# Altium project Arduino_Nano.PrjPcb
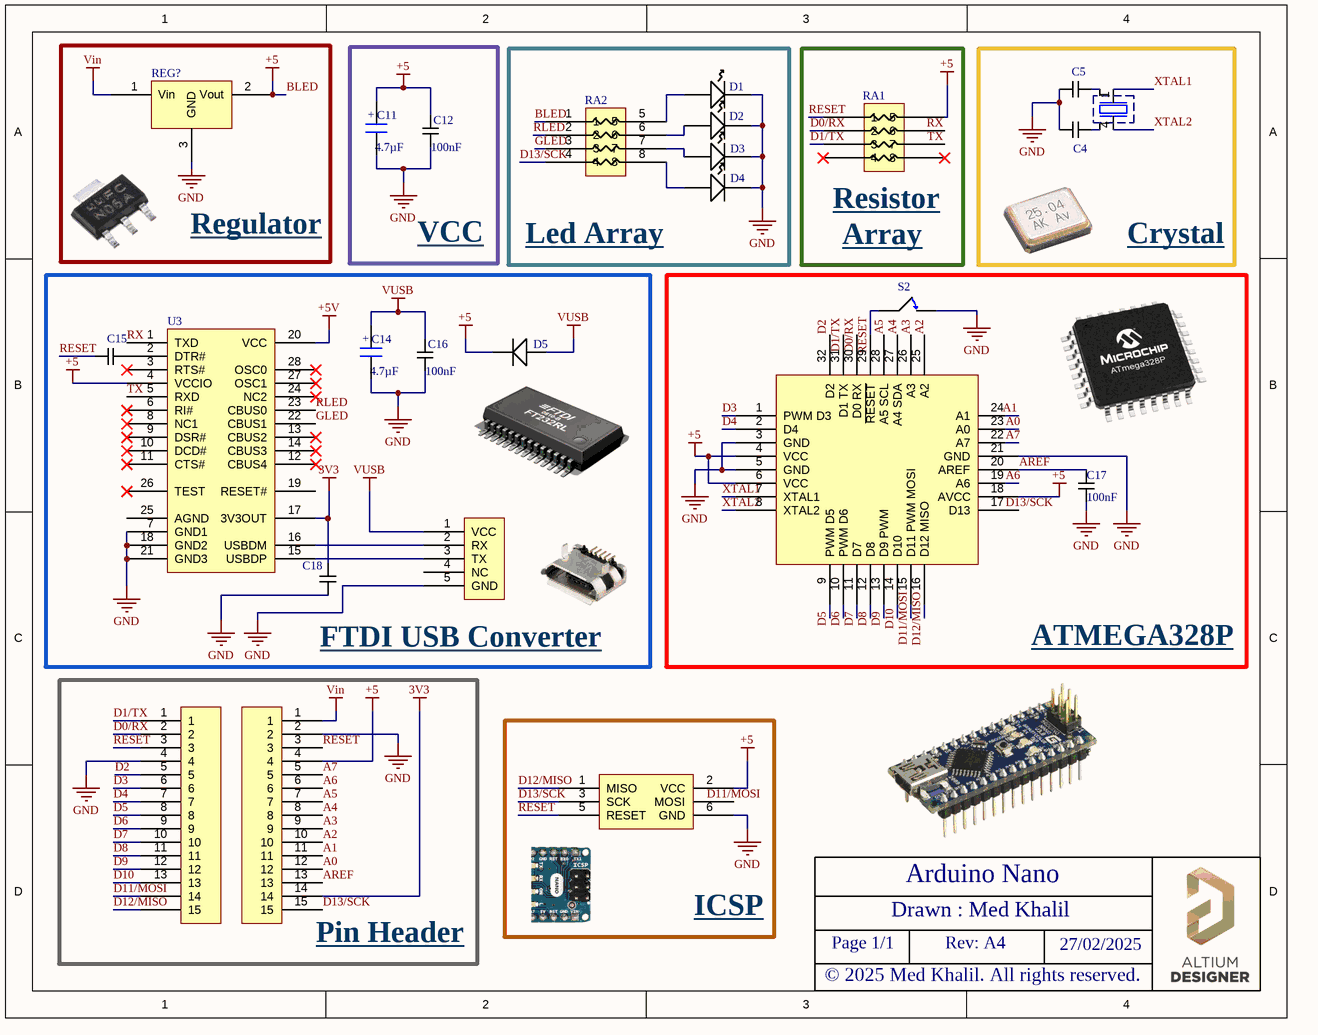
[diagram p0: Sheet1.SchDoc]
Date: 26/02/2025; Designer: Med Khalil; Project: Arduino Nano
1 sheet, 25 parts. Net scope: global (net labels, ports and power ports of the same name join across sheets).
Board file: PCB1.PcbDoc

## Sheet Sheet1.SchDoc
size A; SheetNumber: 1; SheetTotal: 1; ENG_APP_DATE: --/--/--; DSN_APP_DATE: --/--/--; CHK_APP_DATE: --/--/--

### Parts
1  Aker 16MHz Crystal SMT  [Aker S5C Crystal]  (value not drawn)
C4  C0805C180J5GACTU  [CAPCP2012X09N]  (value not drawn)
C5  C0805C180J5GACTU  [CAPCP2012X09N]  (value not drawn)
C11  value 4.7µF  [CASE A - 3216X18]  (hidden comment: Capacitor SMT Tantalum)
C12  Capacitance: 100nF  [CAPCP2012X09N]  (hidden comment: 100nF Ceramic Multilayer Capacitor_1)
C14  value 4.7µF  [CASE A - 3216X18]  (hidden comment: Capacitor SMT Tantalum)
C15  C0805C180J5GACTU  [CAPCP2012X09N]  (value not drawn)
C16  Capacitance: 100nF  [CAPCP2012X09N]  (hidden comment: 100nF Ceramic Multilayer Capacitor_1)
C17  Capacitance: 100nF  [CAPCP2012X09N]  (hidden comment: 100nF Ceramic Multilayer Capacitor_1)
C18  100nF Ceramic Multilayer Capacitor_1  [CAPCP2012X09N]  (value not drawn)
D1  Kingbright Blue LED, 60 mcd 120 ° 0805  [LED1913X12NBLUE]  (value not drawn)
D2  Kingbright Red LED, 100 mcd 120 ° 0805  [LED1913X12NRED]  (value not drawn)
D3  Kingbright Green LED, 70 mcd 120 ° 0805  [LED1913X12NGREEN]  (value not drawn)
D4  Kingbright Orange LED, 200 mcd 120 ° 0805  [LED1913X12NYEL/ORANGE]  (value not drawn)
D5  Panasonic DB2J20900L Schottky Diode, 0.5A, 20V, 2.4ns, 2-Pin SMini2 F5 B  [DIOM1712X07N]  (value not drawn)
RA1  1k +- 5% SMT Resistor Array  [1206 RA]  (value not drawn)
RA2  680+- 5% SMT Resistor Array  [1206 RA]  (value not drawn)
REG?  (no value)  [SOT230P700X180-4N]
S2  Button Tactile Switch, NO 0.05 A 0.8mm  [Button8014X17N]  (value not drawn)
S4  connector;str header;single row;.1 cont centers;.095 tail;gold or gtx;36 contact  [Header]  (value not drawn)
S5  Programming Headers Dual Row  [ISP HEADER]  (value not drawn)
S11  connector;str header;single row;.1 cont centers;.095 tail;gold or gtx;36 contact  [Header]  (value not drawn)
S12  NewMolex Right Angle SMT Female Type B Micro USB Connector, 30 V ac, 1.8A  [MicroUSB]  (value not drawn)
U3  FT232RL, Universal Asynchronous Receiver & Transmitter 3MBd, 28-Pin, SSOP  [SOP65P780X200-28N]  (value not drawn)
U4  ATMEGA328P-AU  [TQFP80P900X900X120-32N]  (value not drawn)

### Blocks framed on the sheet
Regulator: REG?
VCC: C11 C12
Led Array: D1-D4 RA2
Crystal: 1 C4 C5
FTDI USB Converter: C14-C16 C18 D5 S12 U3
ATMEGA328P: C17 S2 U4
Pin Header: S4 S11
ICSP: S5

### Nets
3V3: C18.2 S11.14 U3.17(3V3OUT)
+5V: U3.20(VCC)
BLED: C11.1 C12.2 D5.1 RA1.5 RA2.1 REG?.2(Vout) S5.2(VCC) S11.4 U3.4(VCCIO) U4.4(VCC) U4.6(VCC) U4.18(AVCC)  [also labelled +5]
GND: C4.2 C5.2 C11.2 C12.1 C14.2 C16.1 C17.1 C18.1 D1.2(K) D2.2(K) D3.2(K) D4.2(K) REG?.3(GND) S2.1 S4.4 S5.6(GND) S11.2 S12.5(GND) U3.7(GND1) U3.18(GND2) U3.21(GND3) U4.3(GND) U4.5(GND) U4.21(GND)
Vin: REG?.1(Vin) S11.1
VUSB: C14.1 C16.2 D5.2 S12.1(VCC)
A0: S11.12 U4.23(A0)
A1: S11.11 U4.24(A1)
A2: S11.10 U4.26(A3)
A3: S11.9 U4.27(A4_SDA)
A4: S11.8 U4.28(A5_SCL)
A5: C15.1 RA1.1 S2.1 S4.3 S5.5(RESET) S11.3 S11.7 U4.29(~{RESET})  [also labelled RESET]
A6: S11.6 U4.19(A6)
A7: S11.5 U4.22(A7)
AREF: C17.2 S11.13 U4.20(AREF)
D0/RX: RA1.2 S4.2 U4.30(D0_RX)
D1/TX: RA1.3 S4.1 U4.31(D1_TX)
D2: S4.5 U4.32(D2)
D3: S4.6 U4.1(PWM_D3)
D4: S4.7 U4.2(D4)
D5: S4.8 U4.9(PWM_D5)
D6: S4.9 U4.10(PWM_D6)
D7: S4.10 U4.11(D7)
D8: S4.11 U4.12(D8)
D9: S4.12 U4.13(D9_PWM)
D10: S4.13 U4.14(D10)
D11/MOSI: S4.14 S5.4(MOSI) U4.15(D11_PWM_MOSI)
D12/MISO: S4.15 S5.1(MISO) U4.16(D12_MISO)
D13/SCK: RA2.4 S5.3(SCK) S11.15
GLED: RA2.3 U3.22(CBUS1)
RLED: RA2.2 U3.23(CBUS0)
RX: RA1.6 U3.1(TXD)
TX: RA1.7 U3.5(RXD)
XTAL1: 1.1 U4.7(XTAL1)
XTAL2: 1.4 U4.8(XTAL2)
Net1_2: 1.2(Gnd) C4.1
Net1_3: 1.3(Gnd) C5.1
NetC15_2: C15.2 U3.2(DTR#)
NetD1_1: D1.1(A) RA2.5
NetD2_1: D2.1(A) RA2.6
NetD3_1: D3.1(A) RA2.7
NetD4_1: D4.1(A) RA2.8
NetS12_2: S12.2(RX) U3.16(USBDM)
NetS12_3: S12.3(TX) U3.15(USBDP)

Not connected (* = marked no-connect by the designer): RA1 4* 8*; S12 4(NC); U3 3(RTS#)* 6(RI#)* 8(NC1)* 9(DSR#)* 10(DCD#)* 11(CTS#)* 12(CBUS4)* 13(CBUS2)* 14(CBUS3)* 19(RESET#) 24(NC2)* 25(AGND) 26(TEST)* 27(OSC1)* 28(OSC0)*; U4 17(D13) 25(A2)

### Notes on the sheet
- (near RA1) Resistor
- Array
- Arduino Nano
- Page 1/1
- Drawn : Med Khalil
- Rev: A4
- 27/02/2025
- © 2025 Med Khalil. All rights reserved.
- Labels drawn without touching a wire or pin: D13/SCK
- DWG. NO.
- REV.
- SHT.
- REVISION
- DESCRIPTION
- DATE
- APPROVED
- THIS DOCUMENT AND THE DATA DISCLOSED HEREIN OR HEREWITH IS THE PROPERTY OF ALTIUM LIMITED AND MAY BE FREELY DISTRIBUTED IN WHOLE. NO RIGHTS ARE RESERVED OR EXPRESS OR IMPLIED WARANTEE GIVEN.
- ENG:
- DSN:
- APPROVALS
- PROJECT
- DOCUMENT REVISION:
- DESIGN ITEM:
- CHK:
- BOM:
- REFERENCE DOCUMENTS
- PROJECT REVISION:
- TITLE
- FAB DWG:
- PCB DWG:
- ASSY DWG:
- SCALE:
- SIZE
- C
- CAGE CODE
- FILE NAME
- DWG NO.
- SHEET
- OF
- REV
- (in symbol 4.7µF Tant RS 496-3545) +

### Library data of the parts
1 = Aker  C5S-16.000-12-3030-X: Aker S5C SMT Crystal; Load Capacitance: 12pF; Frequency Stability: +/-30ppm; RS: RS 671-9488; Creator: R Kanjee; Manufacturer: Aker; Manufacturer Part #: C5S-16.000-12-3030-X; Supplier: RS; RS Stock Nr.: 671-9488; HelpURL: http://za.rs-online.com/web/p/crystal-units/6719488/; Package: 3.2x5mm SMD; Value: 16MHz
C4 C5 = 18pF Ceramic Multilayer Capacitor, 50 V dc C0G Dielectric ±5% SMD: Manufacturer: Kemet; Voltage: 50V; Capacitance: 15pF; Creator: Ritesh Kanjee; Date Created: 18 February 2015; Package: 0805; RS Stock No.: 648-0935; Datasheet URL: http://za.rs-online.com/web/p/ceramic-multilayer-capacitors/6480935/?searchTerm=C0805C180J5GACTU&relevancy-data=636F3D3226696E3D4931384E4B6E6F776E41734D504E266C753D656E266D6D3D6D61746368616C6C7061727469616C26706D3D5E5B5C707B4C7D5C707B4E647D2D2C2F255C2E5D2B2426706F3D313326736E3D592673743D4D414E5F504152545F4E554D4245522677633D424F5448267573743D4330383035433138304A35474143545526
C11 C14 = 4.7µF Tant RS 496-3545: Capacitor,tantalum,SMT,16V,4.7uF,10%,A-case; Part Originator: H Theron; RS Stock Nr.: 496-3545; Tolerance: 10%; Package: 3216-18; Publisher: DPSS; LatestRevisionDate: 28-April-2010; ComponentLink1Description: Supplier Website; ComponentLink1URL: http://za.rs-online.com/web/search/searchBrowseAction.html?method=getProduct&R=4963545; ComponentLink2Description: RS Data sheet; ComponentLink2URL: http://docs-europe.origin.electrocomponents.com/webdocs/04ed/0900766b804ed4cc.pdf; Voltage: 16V
C12 C16-C18 = 100nF Ceramic Multilayer Capacitor_1: AVX 0805 Standard 100nF Ceramic Multilayer Capacitor, 50 V dc X7R Dielectric ±10% SMD; Voltage: 50V; Creator: Ritesh Kanjee; Date Created: 18 February 2015; Package: 0805; Manufacturer: AVX; RS Stock No.: 464-6688; Datasheet URL: http://za.rs-online.com/web/p/ceramic-multilayer-capacitors/4646688/
  C18: Capacitance: 100nF
C15 = 18pF Ceramic Multilayer Capacitor, 50 V dc C0G Dielectric ±5% SMD: Manufacturer: Kemet; Voltage: 50V; Creator: Ritesh Kanjee; Date Created: 18 February 2015; Package: 0805; RS Stock No.: 648-0935; Datasheet URL: http://za.rs-online.com/web/p/ceramic-multilayer-capacitors/6480935/?searchTerm=C0805C180J5GACTU&relevancy-data=636F3D3226696E3D4931384E4B6E6F776E41734D504E266C753D656E266D6D3D6D61746368616C6C7061727469616C26706D3D5E5B5C707B4C7D5C707B4E647D2D2C2F255C2E5D2B2426706F3D313326736E3D592673743D4D414E5F504152545F4E554D4245522677633D424F5448267573743D4330383035433138304A35474143545526; Capacitance: 18pF
D1 = Kingbright Blue LED, 60 mcd 120 ° 0805: Manufacturer Part No.: KP-2012PBC-A; Forward Voltage: 3.2V; Creator: Ritesh Kanjee; Date Created: 18 February 2015; Manufacturer: KingBright; RS Stock No.: 466-3784; Datasheet URL: http://za.rs-online.com/web/p/visible-leds/4663784/; Color: Blue
D2 = Kingbright Red LED, 100 mcd 120 ° 0805: Manufacturer Part No.: KP-2012SRC-PRV; Forward Voltage: 1.85V; Creator: Ritesh Kanjee; Date Created: 18 February 2015; Manufacturer: KingBright; RS Stock No.: 466-3813; Datasheet URL: http://za.rs-online.com/web/p/visible-leds/4663813/; Color: RED
D3 = Kingbright Green LED, 70 mcd 120 ° 0805: Manufacturer Part No.: KP-2012MGC; Forward Voltage: 2.1 V; Creator: Ritesh Kanjee; Date Created: 18 February 2015; Manufacturer: KingBright; RS Stock No.: 466-3778; Datasheet URL: http://za.rs-online.com/web/p/visible-leds/4663778/; Color: Green
D4 = Kingbright Orange LED, 200 mcd 120 ° 0805: Manufacturer Part No.: KP-2012SEC; Forward Voltage: 1.85V; Creator: Ritesh Kanjee; Date Created: 18 February 2015; Manufacturer: KingBright; RS Stock No.: 466-3790; Datasheet URL: http://za.rs-online.com/web/p/visible-leds/4663790/; Color: Orange
D5 = Schottky Diode, 0.5A, 20V, 2.4ns, 2-Pin SMini2 F5 B: Created By: R Kanjee; Date Created: 1 March 2015; Manufacturer: Panasonic; RS Stock No.: 713-2703; Manufacturer Part No.: DB2J20900L; Datasheet: http://docs-europe.electrocomponents.com/webdocs/1398/0900766b813986b3.pdf; Maximum Continuous Forward Current: 0.5A; Peak Reverse Repetitive Voltage: 20V
RA1 = 1k +- 5% SMT Resistor Array: 1k +- 5% SMT Resistor Array 4 Res; Manufacturer: Bourns; Manufacturer Part No.: CAY16-102J4LF; Wattage: 0.25W; Creator: R Kanjee; RS Stock No.: 552-5579; Date Created: 25 February 2015
RA2 = 680 +- 5% SMT Resistor Array 4 Res 1206: Manufacturer: Bourns; Manufacturer Part No.: CAY16-681J4LF; Wattage: 0.25W; Creator: R Kanjee; RS Stock No.: 552-5579; Date Created: 25 February 2015
REG? = LM1117MP-5.0: LM1117MP-5.0/NOPB, Low Dropout Voltage Regulator, 1.5A, 5 V ±1%, 4-Pin SOT-223; Manufacturer: Texas Instruments; Supply Current: 1.5Amps; Output Voltage: 5V; Maximum Input Voltage: 15V; Date Created: 26 February 2015; Created By: R Kanjee; RS Stock No.: 533-9583; Datasheet URL: http://za.rs-online.com/web/p/low-dropout-voltage-regulators/5339583/
S2 = Button Tactile Switch, NO 0.05 A 0.8mm: Manufacturer: C & K; Manufacturer Part No.: B3F1000; State: Normaly Open; Date Created: 25 February 2015; Creator: R Kanjee; RS Stock No.: 516-255
S4 S11 = Single row; PCB headers: Manufacturer: FCI; Manufacturer Part No.: 68000-236HLF; Current Rating: 3Amps Continuous; Created By: R Kanjee; Date Created: 1 March 2015; RS Stock No.: 2509565626
S5 = Programming ISP, Programming Headers Dual Row: Manufacturer: FCI; Manufacturer Part No.: 68000-236HLF; Current Rating: 3Amps Continuous; Created By: R Kanjee; Date Created: 1 March 2015; RS Stock No.: 2509565626
S12 = Micro USB Connector, 30 V ac, 1.8A: Manufacturer: Molex; Manufacturer Part No.: 105017-0001; Max Voltage: 30V; Creator: R Kanjee; Date Created: 28 February 2015; Datasheet URL: http://za.rs-online.com/web/p/micro-usb-connectors/8486764/; Max Current: 1.8A; RS Stock No: 848-6764
U3 = FT232RL USB to UART, Universal Asynchronous Receiver & Transmitter 3MBd, 28-Pin, SSOP: Manufacturer: FTDI Chip; Creator: R Kanjee; Date Created: 03 March 2015; Manufacturer Part No.: FT232RL; RS Stock No.: 406-580; Pin Count: 28
U4 = ATMEGA328P-AU: ATMEGA328P-AU, 8 bit AVR Microcontroller 20MHz 1 kB, 32 kB Flash, 2 kB RAM, I2C 32-Pin TQFP; Company: Lumina Inova; Created By: Ritesh Kanjee; Date Created: 14 February 2015; RS Stock No.: 696-3092; Datasheet URL: http://docs-europe.electrocomponents.com/webdocs/0db4/0900766b80db4deb.pdf